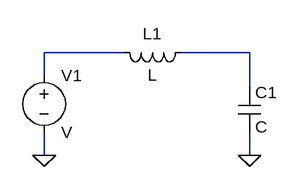
[diagram p0: schematic Draft2.asc]
Draft2.asc, the LTspice schematic file:
Version 4
SHEET 1 880 680
WIRE 160 80 48 80
WIRE 336 80 240 80
WIRE 48 112 48 80
WIRE 336 128 336 80
WIRE 48 224 48 192
WIRE 336 224 336 192
FLAG 48 224 0
FLAG 336 224 0
SYMBOL voltage 48 96 R0
SYMATTR InstName V1
SYMBOL ind 256 64 R90
WINDOW 0 5 56 VBottom 2
WINDOW 3 32 56 VTop 2
SYMATTR InstName L1
SYMBOL cap 320 128 R0
SYMATTR InstName C1

The netlist it stands for:
* Draft2.asc
V1 N001 0 V
L1 N002 N001 L
C1 N002 0 C
.backanno
.end